# EAGLE schematic sensor_node_complete (EAGLE 7.2.0)
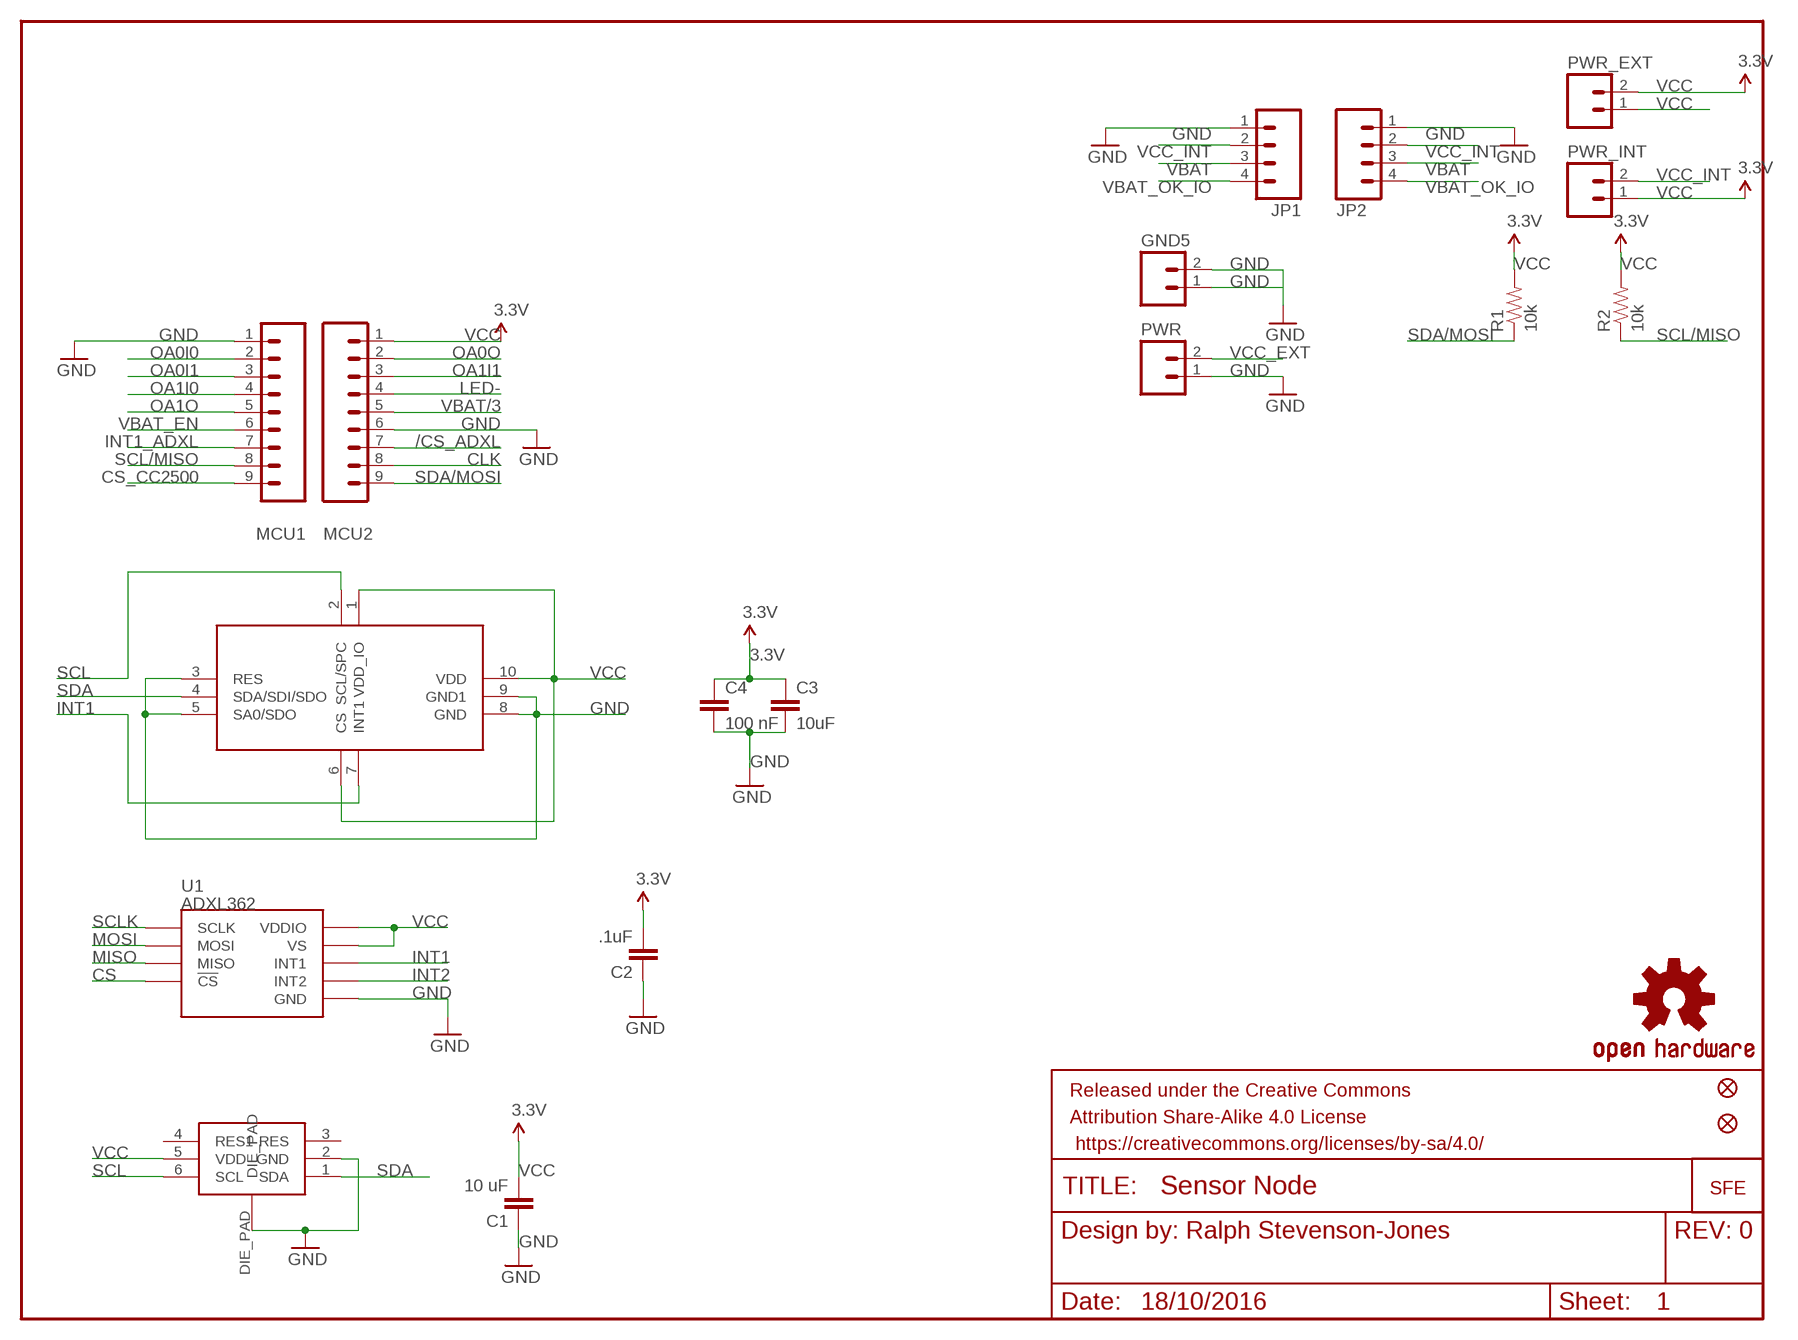
[diagram p0: schematic, sheet 1]

## Parts
C1  10 uF  CAP0805-CAP  [0805-CAP]
C2  .1uF  CAP0402-CAP  [0402-CAP]
C3  10uF  CAP0805-CAP  [0805-CAP]
C4  100 nF  CAP0805-CAP  [0805-CAP]
FRAME1  FRAME-LETTER  [CREATIVE_COMMONS]
GND5  M02PTH  [1X02]
JP1  M04PTH  [1X04]
JP2  M04PTH  [1X04]
JP3  LOGO-SFESK  [SFE-LOGO-FLAME]
JP4  FIDUCIALUFIDUCIAL  [MICRO-FIDUCIAL]
JP5  FIDUCIALUFIDUCIAL  [MICRO-FIDUCIAL]
MCU1  M09  [1X09]
MCU2  M09  [1X09]
PWR  M02PTH  [1X02]
PWR_EXT  M02PTH  [1X02]
PWR_INT  M02PTH  [1X02]
R1  10k  RESISTOR0805  [0805-RES]
R2  10k  RESISTOR0805  [0805-RES]
U1  ADXL362  [ADXL362]
U$1  SHT21!  [SHT21]
U$2  OSHW-LOGOS  [OSHW-LOGO-S]
U$3  LPS25HLPS25H  [LPS25H]

## Nets
3.3V: C3.1 C4.1
/CS_ADXL: MCU2.7
CLK: MCU2.8
CS: U1.P$8(!CS)
CS_CC2500: MCU1.9
GND: C1.1 C2.1 C3.2 C4.2 GND5.1 GND5.2 JP1.1 JP2.1 MCU1.1 MCU2.6 PWR.1 U1.P$12(GND) U1.P$13(GND) U1.P$16(GND) U$1.2(GND) U$1.DIE_PAD U$3.3(RES) U$3.5(SA0/SDO) U$3.8(GND) U$3.9(GND1)
INT1: U1.P$11(INT1) U$3.7(INT1)
INT1_ADXL: MCU1.7
INT2: U1.P$9(INT2)
LED-: MCU2.4
MISO: U1.P$7(MISO)
MOSI: U1.P$6(MOSI)
OA0I0: MCU1.2
OA0I1: MCU1.3
OA0O: MCU2.2
OA1I0: MCU1.4
OA1I1: MCU2.3
OA1O: MCU1.5
SCL: U$1.6(SCL) U$3.2(SCL/SPC)
SCL/MISO: MCU1.8 R2.1
SCLK: U1.P$4(SCLK)
SDA: U$1.1(SDA) U$3.4(SDA/SDI/SDO)
SDA/MOSI: MCU2.9 R1.1
VBAT: JP1.3 JP2.3
VBAT/3: MCU2.5
VBAT_EN: MCU1.6
VBAT_OK_IO: JP1.4 JP2.4
VCC: C1.2 C2.2 MCU2.1 PWR_EXT.1 PWR_EXT.2 PWR_INT.1 R1.2 R2.2 U1.P$1(VDDIO) U1.P$14(VS) U$1.5(VDD) U$3.1(VDD_IO) U$3.6(CS) U$3.10(VDD) ; supply symbol labelled 3.3V
VCC_EXT: PWR.2
VCC_INT: JP1.2 JP2.2 PWR_INT.2
Unconnected: U$1.3(RES) U$1.4(RES1)

## Library data of the parts
C1 = passive_components:CAP: Capacitor Standard 0603 ceramic capacitor, and 0.1" leaded capacitor.
C2 = SparkFun-Passives:CAP: Capacitor Standard 0603 ceramic capacitor, and 0.1" leaded capacitor.; PROD_ID: CAP-00810
C3 C4 = SparkFun-Capacitors:CAP: Capacitor Standard 0603 ceramic capacitor, and 0.1" leaded capacitor.
FRAME1 = SparkFun-Aesthetics:FRAME-LETTER: Schematic Frame Standard 8.5x11 US Letter frame; DESIGNER: Ralph Stevenson-Jones; VERSION: v01
GND5 PWR PWR_EXT PWR_INT = SparkFun-Connectors:M02: Standard 2-pin 0.1" header. Use with - straight break away headers ( PRT-00116) - right angle break away headers (PRT-00553) - swiss pins (PRT-00743) - machine pins (PRT-00117) - female headers (PRT-00115) Molex polarized connector foot print use with: PRT-08233 with associated crimp pins and housings. 2.54_SCREWTERM for use with PRT-10571. 3.5mm Screw Terminal footprints for PRT-08084 5mm Screw Terminal footprints for use with PRT-08432
JP1 JP2 = SparkFun-Connectors:M04: Header 4 Standard 4-pin 0.1" header. Use with straight break away headers (SKU : PRT-00116), right angle break away headers (PRT-00553), swiss pins (PRT-00743), machine pins (PRT-00117), and female headers (PRT-00115). Molex polarized connector foot print use with SKU : PRT-08231 with associated crimp pins and housings. 1MM SMD Version SKU: PRT-10208
JP3 = SparkFun-Aesthetics:LOGO-SFE: Spark Fun Electronics PCB Logo This is the standard Spark Fun Electronics PCB logo.
JP4 JP5 = SparkFun:FIDUCIAL: Fiducial Alignment Points Various fiducial points for machine vision alignment.
MCU1 MCU2 = SparkFun-Connectors:M09: Header 9 Standard 9-pin 0.1" header. Use with straight break away headers (SKU : PRT-00116), right angle break away headers (PRT-00553), swiss pins (PRT-00743), machine pins (PRT-00117), and female headers (PRT-00115).
R1 R2 = passive_components:RESISTOR: Resistor Basic schematic elements and footprints for 0603, 1206, and PTH resistors.
U1 = integrated_circuits:ADXL362: Micropower 3-axis accelerometer 2/4/8g digital output (SPI) IC-11297; PROD_ID: IC-11297
U$1 = integrated_circuits:SHT21
U$2 = SparkFun-Aesthetics:OSHW-LOGO: Open Source Hardware Logo This logo indicates the piece of hardware it is found on incorporates a OSHW license and/or adheres to the definition of open source hardware found here: http://freedomdefined.org/OSHW
U$3 = sensors:LPS25H